# Altium schematic sheet E17-04-ISO_SPI.SchDoc
size A; DocumentNumber: 3; SheetNumber: 3; SheetTotal: 18
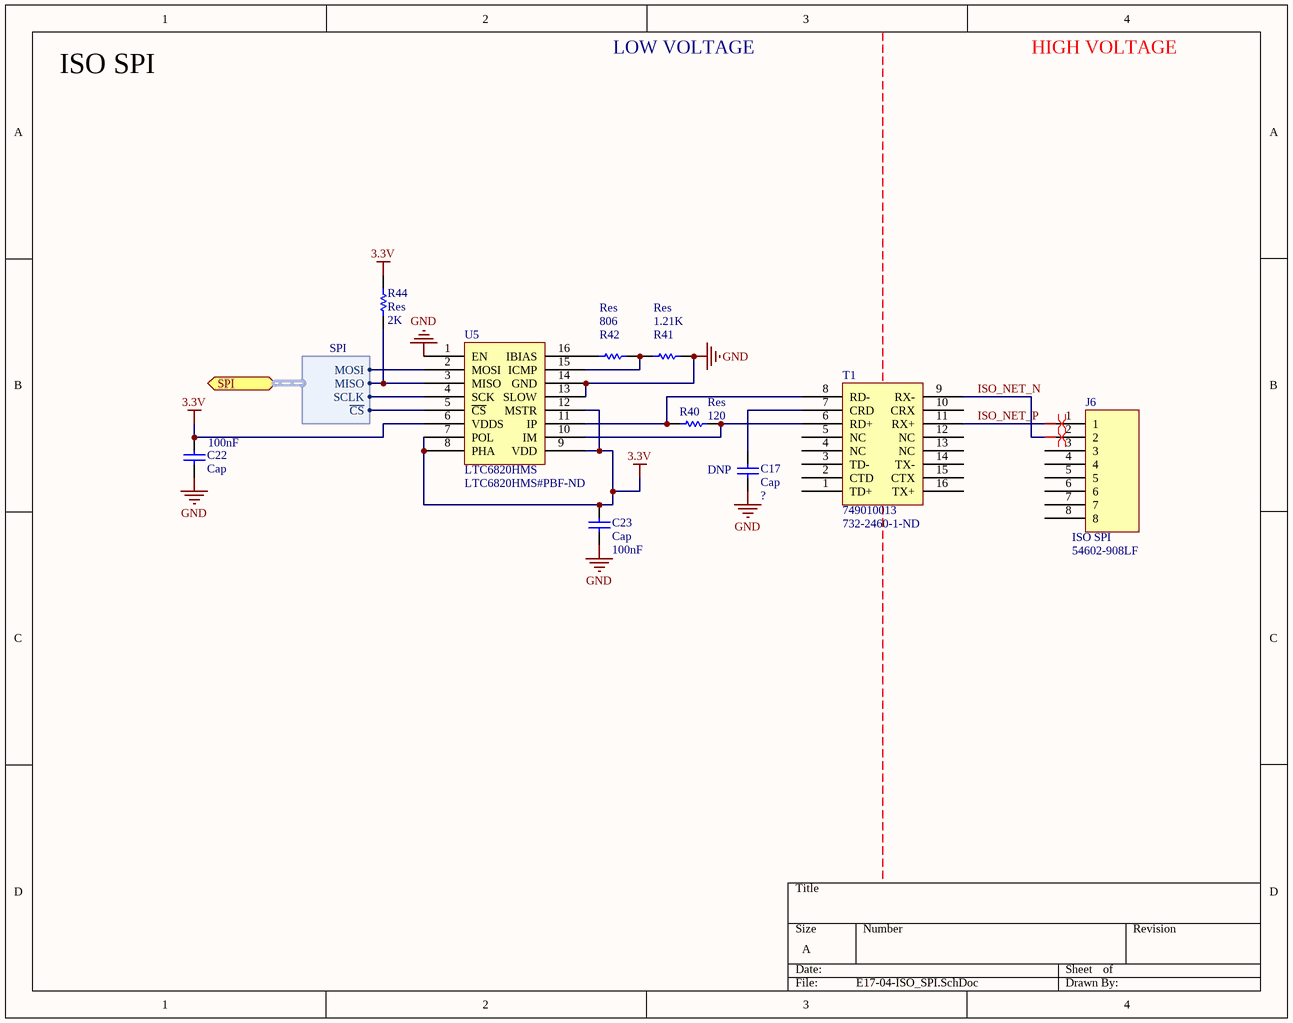
[diagram p0: E17-04-ISO_SPI.SchDoc]

## Parts
C17  Cap  STUFF: DNP  [C0805]
C22  Cap  value 100nF  [C0805]
C23  Cap  value 100nF  [C0805]
J6  ISO SPI  [54602-908LF]
R40  Res  value 120  [2012[0805]]
R41  Res  value 1.21K  [2012[0805]]
R42  Res  value 806  [2012[0805]]
R44  Res  value 2K  [2012[0805]]
T1  749010013  Supplier Part Number 1: 732-2460-1-ND  [749010013]
U5  LTC6820HMS  Supplier Part Number 1: LTC6820HMS#PBF-ND  [LTC6820HMS]

## Ports
SPI (harness SPI)

## Harnesses
SPI: ~{CS}, MOSI, MISO, SCLK

## Nets
3.3V: C22.2 C23.2 R44.1 U5.6(VDDS) U5.7(POL) U5.8(PHA) U5.9(VDD) U5.12(MSTR)
GND: C17.1 C22.1 C23.1 R41.1 U5.1(EN) U5.13(SLOW) U5.14(GND)
ISO_NET_N: J6.2 T1.9(RX-)
ISO_NET_P: J6.1 T1.11(RX+)
NetC17_2: C17.2 T1.7(CRD)
NetR40_1: R40.1 T1.6(RD+) U5.10(IM)
NetR40_2: R40.2 T1.8(RD-) U5.11(IP)
NetR41_2: R41.2 R42.1 U5.15(ICMP)
NetR42_2: R42.2 U5.16(IBIAS)
NetR44_2: R44.2 U5.3(MISO) ; port SPI.MISO
NetU5_2: U5.2(MOSI) ; port SPI.MOSI
NetU5_4: U5.4(SCK) ; port SPI.SCLK
NetU5_5: U5.5(~{CS}) ; port SPI.~{CS}

Not connected (* = marked no-connect by the designer): J6 3 4 5 6 7 8; T1 1(TD+) 2(CTD) 3(TD-) 4(NC) 5(NC) 10(CRX) 12(NC) 13(NC) 14(TX-) 15(CTX) 16(TX+)

## Layout directives
differential pair: ISO_NET_N, ISO_NET_P

## Notes on the sheet
- ISO SPI
- LOW VOLTAGE
- HIGH VOLTAGE

## Library data of the parts
C17 C22 C23 = Cap: Capacitor; Published: 8-Jun-2000; LatestRevisionDate: 17-Jul-2002; LatestRevisionNote: Re-released for DXP Platform.; PackageReference: C1206; Publisher: Altium Limited
  C17: Value: ?
J6 = 54602-908LF: CONN MOD JACK R/A 8P8C; Supplier 1: Digi-Key; Supplier Part Number 1: 609-1046-ND; MPN: 54602-908LF
R40-R42 R44 = Res: Surface Mount Resistor; Published: 8-Jun-2000; LatestRevisionDate: 17-Jul-2002; LatestRevisionNote: Re-released for DXP Platform.; PackageReference: AXIAL-0.5; Publisher: Altium Limited
T1 = 749010013: TRANSFORMER LAN 10/100 SMD; Supplier 1: Digi-Key
U5 = LTC6820HMS: IC COMM INTERFACE ISOSPI; Supplier 1: Digi-Key